# Altium schematic sheet GPS.SchDoc
size A
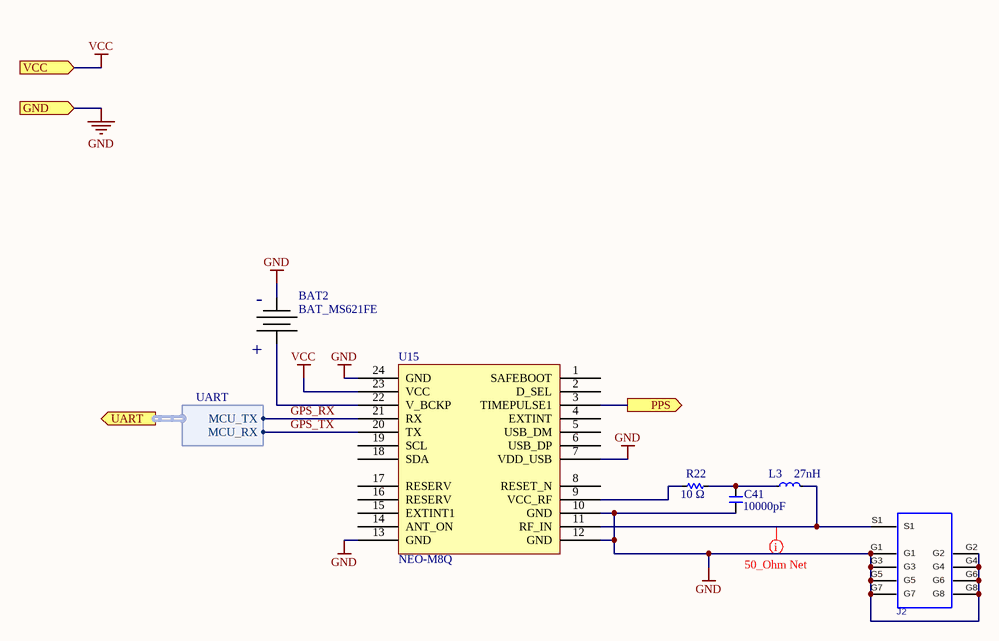
[diagram p0: GPS.SchDoc]

## Parts
BAT2  BAT_MS621FE  [BATT_COINCELL_RECHARGEABLE]
C41  Capacitance (shorthand): 10000pF  [C0603]  (hidden comment: 490-1512-1-ND)
J2  SMA-J-P-X-ST-EM2  [SMA-J-P-X-ST-EM1]  (value not drawn)
L3  Inductance: 27nH  [R0402]  (hidden comment: 490-15373-1-ND)
R22  Resistance: 10 Ω  [R0603]  (hidden comment: 311-10.0HRCT-ND)
U15  NEO-M8Q  [NEO_M8]

## Ports
GND (in), PPS (out), UART (out, harness UART), VCC (in)

## Harnesses
UART: MCU_RX, MCU_TX

## Nets
GND: BAT2.- C41.1 J2.G1 J2.G2 J2.G3 J2.G4 J2.G5 J2.G6 J2.G7 J2.G8 U15.7(VDD_USB) U15.10(GND) U15.12(GND) U15.13(GND) U15.24(GND) ; port GND
VCC: U15.23(VCC) ; port VCC
GPS_RX: U15.21(RX) ; port UART.MCU_TX
GPS_TX: U15.20(TX) ; port UART.MCU_RX
PPS: U15.3(TIMEPULSE1) ; port PPS
NetBAT2_+: BAT2.+ U15.22(V_BCKP)
NetC41_2: C41.2 L3.1 R22.2
NetJ2_S1: J2.S1 L3.2 U15.11(RF_IN)
NetR22_1: R22.1 U15.9(VCC_RF)

Not connected (* = marked no-connect by the designer): U15 1(SAFEBOOT) 2(D_SEL) 4(EXTINT) 5(USB_DM) 6(USB_DP) 8(RESET_N) 14(ANT_ON) 15(EXTINT1) 16(RESERV) 17(RESERV) 18(SDA) 19(SCL)

## Layout directives
rule Clearance Constraint [Generic clearance = 0mil, and 21 value(s) for objects]: NetJ2_S1

## Library data of the parts
BAT2 = CMP-060-0000-1: MS621FE RECHARGEABLE COIN CELL BACKUP; Manufacturer: Seiko Instruments; Manufacturer Part Number: MS621FE-FL11E; Battery Chemistry: Lithium; Battery Cell Size: Coin, 6.8mm; Capacity: 5.5mAh; Discharge Rate: 15µA; Shipping Info: Due to restrictions, only ground shipment is allowed.; RoHS: RoHS Compliant; Stock 1: 41059; Pricing 1: 1=2.04, 10=1.838, 50=1.6338, 100=1.4296, 250=1.30704, 500=1.22534, 1000=1.09051, 2500=1.0112, 5000=0.99138 (USD); Part Status: Active; Size / Dimension: 0.27" Dia x 0.08" H (6.8mm x 2.1mm); Termination Style: SMD (SMT) Tab; Standard Charge Current: 15µA; Standard Charge Time: -; Weight: 0.23g; ComponentLink1URL: http://www.sii.co.jp/en/me/files/2017/04/MicroBatteryCatalogue-E_2017_web.pdf; ComponentLink1Description: http://www.sii.co.jp/en/me/files/2017/04/MicroBatteryCatalogue-E_2017_web.pdf; Design Item ID: BAT_MS621FE; Source: miscellaneous.SchLib
C41 = CMP-119-0053-1: CAP CER 0603 10000pF X7R 50V 10%; Manufacturer: Murata Electronics North America; Capacitance - pF (Machine readable): #NAME?; Rated Voltage: 50V; Dielectric: X7R
J2 = CMP-025-0000-1: SMA Samtec, Edge Mount, Long Thread. PCB Footprint designed by timv to improve strength, verifived on several PCBs from BAC.
L3 = CMP-123-0062-1: FIXED IND 27NH 680MA 288 MOHM; Manufacturer: Murata Electronics North America; Frequency - Self Resonant: 4GHz; Inductance - nH (Machine readable): 27; Current Rating: 680mA
R22 = CMP-126-0002-2: RES SMD 10 OHM 1% 1/10W 0603; Manufacturer: Yageo; Manufacturer Part Number: RC0603FR-0710RL; Temperature Coefficient: ±200ppm/°C; Resistance (Sortable): 10; Power (Watts): 0.1W, 1/10W; Tolerance: ±1%; Operating Temperature: -55°C ~ 155°C; Image: //media.digikey.com/Renders/Yageo%20Renders/0603-(1608-Metric).jpg; Datasheets: http://www.yageo.com/documents/recent/PYu-RC_Group_51_RoHS_L_9.pdf
U15 = CMP-074-0003-2: Receiver GNSS 24LCC; Design Item ID: NEO_M8; Source: sensor.SchLib